# Altium project 集成晶闸管.PrjPcb
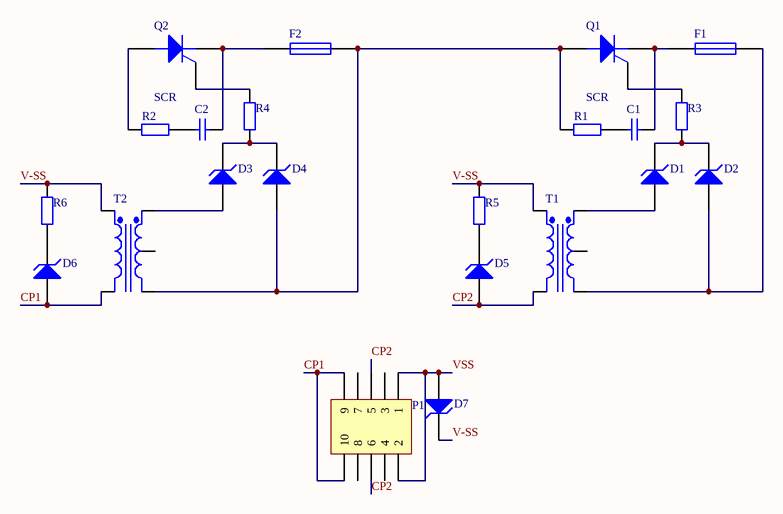
[diagram p0: 集成晶闸管.SchDoc]
1 sheet, 22 parts. Net scope: global (net labels, ports and power ports of the same name join across sheets).
Board file: 集成晶闸管.PcbDoc

## Sheet 集成晶闸管.SchDoc
size A4

### Parts
C1  Cap  [RAD-0.3]  (value not drawn)
C2  Cap  [RAD-0.3]  (value not drawn)
D1  D Zener  [DIODE-0.7]  (value not drawn)
D2  D Zener  [DIODE-0.7]  (value not drawn)
D3  D Zener  [DIODE-0.7]  (value not drawn)
D4  D Zener  [DIODE-0.7]  (value not drawn)
D5  D Zener  [DIODE-0.7]  (value not drawn)
D6  D Zener  [DIODE-0.7]  (value not drawn)
D7  D Zener  [DIODE-0.7]  (value not drawn)
F1  Fuse 1  [PIN-W2/E2.8]  (value not drawn)
F2  Fuse 1  [PIN-W2/E2.8]  (value not drawn)
P1  Header 5X2  [HDR2X5]  (value not drawn)
Q1  SCR  [TO-220-AB]
Q2  SCR  [TO-220-AB]
R1  Res2  [AXIAL-0.4]  (value not drawn)
R2  Res2  [AXIAL-0.4]  (value not drawn)
R3  Res2  [AXIAL-0.4]  (value not drawn)
R4  Res2  [AXIAL-0.4]  (value not drawn)
R5  Res2  [AXIAL-0.4]  (value not drawn)
R6  Res2  [AXIAL-0.4]  (value not drawn)
T1  Trans CT  [TRF_5]  (value not drawn)
T2  Trans CT  [TRF_5]  (value not drawn)

### Nets
CP1: D6.1(A) P1.9 P1.10 T2.2(Pri-)
CP2: D5.1(A) P1.5 P1.6 T1.2(Pri-)
V-SS: D7.2(K) R5.2 R6.2 T1.1(Pri+) T2.1(Pri+)
VSS: D7.1(A) P1.1 P1.2
NetC1_1: C1.1 R1.2
NetC1_2: C1.2 F1.1 Q1.3(K)
NetC2_1: C2.1 R2.2
NetC2_2: C2.2 F2.1 Q2.3(K)
NetD1_1: D1.1(A) T1.3(Sec+)
NetD1_2: D1.2(K) D2.2(K) R3.2
NetD2_1: D2.1(A) F1.2 T1.5(Sec-)
NetD3_1: D3.1(A) T2.3(Sec+)
NetD3_2: D3.2(K) D4.2(K) R4.1
NetD4_1: D4.1(A) F2.2 Q1.1(A) R1.1 T2.5(Sec-)
NetD5_2: D5.2(K) R5.1
NetD6_2: D6.2(K) R6.1
NetQ1_2: Q1.2(G) R3.1
NetQ2_1: Q2.1(A) R2.1
NetQ2_2: Q2.2(G) R4.2

Not connected (* = marked no-connect by the designer): P1 3 4 7 8; T1 4(SecCT); T2 4(SecCT)

### Library data of the parts
C1 C2 = Cap: Capacitor; Value: 100pF; Published: 8-Jun-2000; LatestRevisionDate: 17-Jul-2002; LatestRevisionNote: Re-released for DXP Platform.; PackageReference: RAD-0.3; Publisher: Altium Limited; PackageDescription: Radial Cap, Thru-Hole; 2 Leads; 0.3 in Pin Spacing
D1-D7 = D Zener: Zener Diode; Published: 8-Jun-2000; LatestRevisionDate: 17-Jul-2002; LatestRevisionNote: Re-released for DXP Platform.; PackageReference: DIODE-0.7; Publisher: Altium Limited; PackageDescription: Diode, Thru-Hole; 2 Leads; 0.7 in Pin Spacing
F1 F2 = Fuse 1: Fuse; Published: 8-Jun-2000; LatestRevisionDate: 17-Jul-2002; LatestRevisionNote: Re-released for DXP Platform.; PackageReference: PIN-W2/E2.8; Publisher: Altium Limited; PackageDescription: Thru-Hole; 2 Leads
P1 = Header 5X2: Header, 5-Pin, Dual row; LatestRevisionDate: 17-Jul-2002; LatestRevisionNote: Re-released for DXP Platform.; Publisher: Altium Limited
Q1 Q2 = SCR: Silicon Controlled Rectifier; Published: 8-Jun-2000; LatestRevisionDate: 17-Jul-2002; LatestRevisionNote: Re-released for DXP Platform.; PackageReference: TO-220-AB; Publisher: Altium Limited; Code_JEDEC: TO-220-AB
R1-R6 = Res2: Resistor; Value: 1K; Published: 8-Jun-2000; LatestRevisionDate: 17-Jul-2002; LatestRevisionNote: Re-released for DXP Platform.; PackageReference: AXIAL-0.4; Publisher: Altium Limited; PackageDescription: Axial Device, Thru-Hole; 2 Leads; 0.4 in Pin Spacing
T1 T2 = Trans CT: Center-Tapped Transformer (Coupled Inductor Model); Published: 8-Jun-2000; LatestRevisionDate: 17-Jul-2002; LatestRevisionNote: Re-released for DXP Platform.; PackageReference: TRF_5; Publisher: Altium Limited; PackageDescription: Transformer; 5 Leads